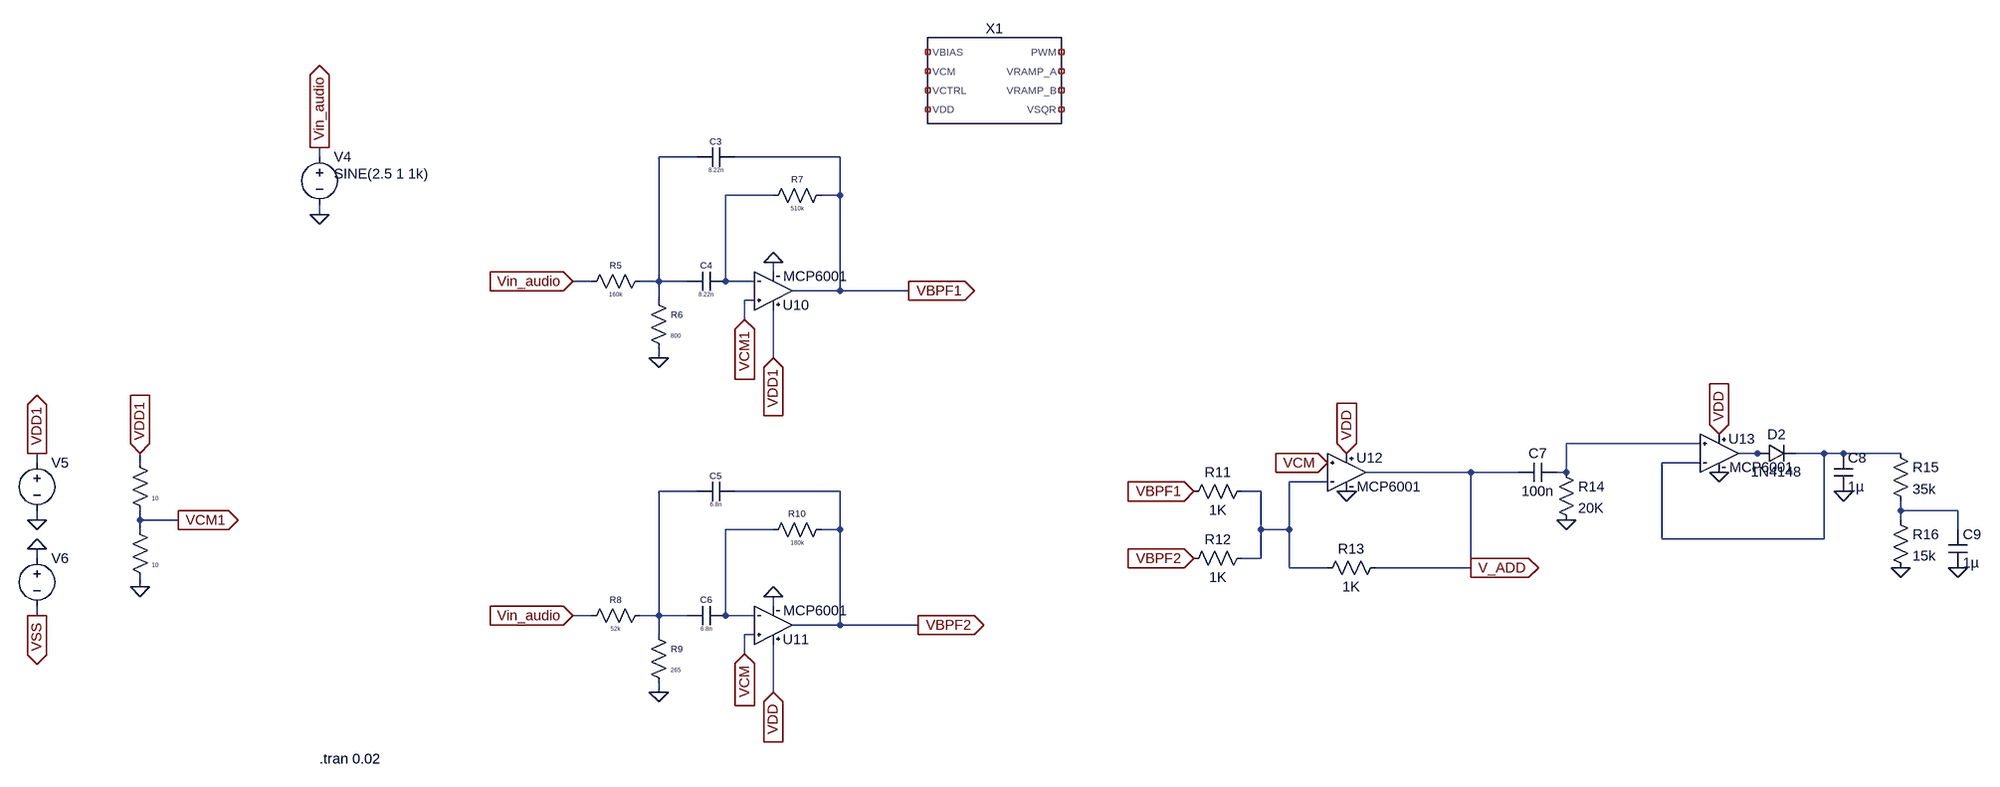
[diagram p0: schematic Draft1.asc]
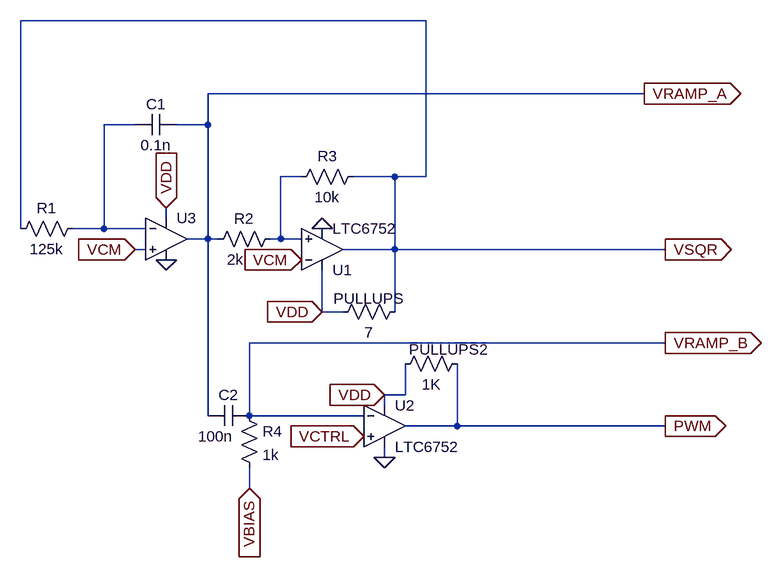
[diagram p1: sub-circuit analoglab_1.asc]
Draft1.asc, the LTspice schematic file:
Version 4.1
SHEET 1 1768 1856
WIRE -1328 832 -1328 816
WIRE -496 832 -560 832
WIRE -256 832 -432 832
WIRE -368 896 -448 896
WIRE -256 896 -256 832
WIRE -256 896 -288 896
WIRE -1328 928 -1328 912
WIRE -368 1024 -368 1008
WIRE -672 1040 -704 1040
WIRE -560 1040 -560 832
WIRE -560 1040 -592 1040
WIRE -512 1040 -560 1040
WIRE -448 1040 -448 896
WIRE -400 1040 -448 1040
WIRE -256 1056 -256 896
WIRE -256 1056 -336 1056
WIRE -128 1056 -256 1056
WIRE -560 1072 -560 1040
WIRE -400 1072 -416 1072
WIRE -416 1104 -416 1072
WIRE -560 1168 -560 1152
WIRE -368 1168 -368 1088
WIRE 1296 1312 1072 1312
WIRE 1392 1328 1360 1328
WIRE 1408 1328 1392 1328
WIRE 1504 1328 1456 1328
WIRE 1536 1328 1504 1328
WIRE 1632 1328 1536 1328
WIRE -1888 1344 -1888 1328
WIRE -1712 1344 -1712 1328
WIRE 1296 1344 1232 1344
WIRE 912 1360 736 1360
WIRE 992 1360 912 1360
WIRE 1072 1360 1072 1312
WIRE 1072 1360 1056 1360
WIRE 672 1376 608 1376
WIRE -496 1392 -560 1392
WIRE -256 1392 -432 1392
WIRE 560 1392 528 1392
WIRE 1632 1424 1632 1408
WIRE 1728 1424 1632 1424
WIRE -1888 1440 -1888 1424
WIRE -1712 1440 -1712 1424
WIRE -1648 1440 -1712 1440
WIRE 1632 1440 1632 1424
WIRE -1712 1456 -1712 1440
WIRE -368 1456 -448 1456
WIRE -256 1456 -256 1392
WIRE -256 1456 -288 1456
WIRE 560 1456 560 1392
WIRE 608 1456 608 1376
WIRE 608 1456 560 1456
WIRE 1728 1456 1728 1424
WIRE 1232 1472 1232 1344
WIRE 1504 1472 1504 1328
WIRE 1504 1472 1232 1472
WIRE -1888 1504 -1888 1488
WIRE 560 1504 560 1456
WIRE 560 1504 528 1504
WIRE 608 1520 608 1456
WIRE 672 1520 608 1520
WIRE 912 1520 912 1360
WIRE 912 1520 752 1520
WIRE -1712 1552 -1712 1536
WIRE -368 1584 -368 1568
WIRE -1888 1600 -1888 1584
WIRE -672 1600 -704 1600
WIRE -560 1600 -560 1392
WIRE -560 1600 -592 1600
WIRE -512 1600 -560 1600
WIRE -448 1600 -448 1456
WIRE -400 1600 -448 1600
WIRE -256 1616 -256 1456
WIRE -256 1616 -336 1616
WIRE -112 1616 -256 1616
WIRE -560 1632 -560 1600
WIRE -400 1632 -416 1632
WIRE -416 1664 -416 1632
WIRE -560 1728 -560 1712
WIRE -368 1728 -368 1648
FLAG -560 1168 0
FLAG -704 1040 Vin_audio
IOPIN -704 1040 In
FLAG -560 1728 0
FLAG -704 1600 Vin_audio
IOPIN -704 1600 In
FLAG -416 1104 VCM1
IOPIN -416 1104 In
FLAG -416 1664 VCM
IOPIN -416 1664 In
FLAG -112 1616 VBPF2
IOPIN -112 1616 Out
FLAG -128 1056 VBPF1
IOPIN -128 1056 Out
FLAG 912 1520 V_ADD
IOPIN 912 1520 Out
FLAG 448 1392 VBPF1
IOPIN 448 1392 In
FLAG 448 1504 VBPF2
IOPIN 448 1504 In
FLAG 672 1344 VCM
IOPIN 672 1344 In
FLAG 1072 1440 0
FLAG 1536 1392 0
FLAG -368 1568 0
FLAG -368 1008 0
FLAG -368 1168 VDD1
IOPIN -368 1168 In
FLAG -368 1728 VDD
IOPIN -368 1728 In
FLAG 704 1392 0
FLAG 1328 1360 0
FLAG 704 1328 VDD
IOPIN 704 1328 In
FLAG 1328 1296 VDD
IOPIN 1328 1296 In
FLAG 1632 1520 0
FLAG 1728 1520 0
FLAG -1328 816 Vin_audio
IOPIN -1328 816 Out
FLAG -1328 928 0
FLAG -1888 1440 0
FLAG -1888 1328 VDD1
IOPIN -1888 1328 Out
FLAG -1888 1488 0
FLAG -1888 1600 VSS
IOPIN -1888 1600 Out
FLAG -1712 1552 0
FLAG -1712 1328 VDD1
IOPIN -1712 1328 In
FLAG -1648 1440 VCM1
IOPIN -1648 1440 Out
SYMBOL analoglab_1 16 704 R0
SYMATTR InstName X1
SYMBOL res -576 1024 R90
WINDOW 0 0 56 VBottom 1
WINDOW 3 32 56 VTop 0
SYMATTR InstName R5
SYMATTR Value 160k
SYMBOL res -576 1056 R0
WINDOW 0 36 40 Left 1
WINDOW 3 36 76 Left 0
SYMATTR InstName R6
SYMATTR Value 800
SYMBOL res -384 912 R270
WINDOW 0 32 56 VTop 1
WINDOW 3 0 56 VBottom 0
SYMATTR InstName R7
SYMATTR Value 510k
SYMBOL cap -432 816 R90
WINDOW 0 0 32 VBottom 1
WINDOW 3 32 32 VTop 0
SYMATTR InstName C3
SYMATTR Value 8.22n
SYMBOL cap -448 1024 R90
WINDOW 0 0 32 VBottom 1
WINDOW 3 32 32 VTop 0
SYMATTR InstName C4
SYMATTR Value 8.22n
SYMBOL res -576 1584 R90
WINDOW 0 0 56 VBottom 1
WINDOW 3 32 56 VTop 0
SYMATTR InstName R8
SYMATTR Value 52k
SYMBOL res -576 1616 R0
WINDOW 0 36 40 Left 1
WINDOW 3 36 76 Left 0
SYMATTR InstName R9
SYMATTR Value 265
SYMBOL res -384 1472 R270
WINDOW 0 32 56 VTop 1
WINDOW 3 0 56 VBottom 0
SYMATTR InstName R10
SYMATTR Value 180k
SYMBOL cap -432 1376 R90
WINDOW 0 0 32 VBottom 1
WINDOW 3 32 32 VTop 0
SYMATTR InstName C5
SYMATTR Value 6.8n
SYMBOL cap -448 1584 R90
WINDOW 0 0 32 VBottom 1
WINDOW 3 32 32 VTop 0
SYMATTR InstName C6
SYMATTR Value 6.8n
SYMBOL res 544 1376 R90
WINDOW 0 0 56 VBottom 2
WINDOW 3 32 56 VTop 2
SYMATTR InstName R11
SYMATTR Value 1K
SYMBOL res 544 1488 R90
WINDOW 0 0 56 VBottom 2
WINDOW 3 32 56 VTop 2
SYMATTR InstName R12
SYMATTR Value 1K
SYMBOL res 768 1504 R90
WINDOW 0 0 56 VBottom 2
WINDOW 3 32 56 VTop 2
SYMATTR InstName R13
SYMATTR Value 1K
SYMBOL cap 1056 1344 R90
WINDOW 0 0 32 VBottom 2
WINDOW 3 32 32 VTop 2
SYMATTR InstName C7
SYMATTR Value 100n
SYMBOL res 1056 1344 R0
SYMATTR InstName R14
SYMATTR Value 20K
SYMBOL cap 1520 1328 R0
SYMATTR InstName C8
SYMATTR Value 1µ
SYMBOL res 1616 1312 R0
SYMATTR InstName R15
SYMATTR Value 35k
SYMBOL diode 1392 1344 R270
WINDOW 0 32 32 VTop 2
WINDOW 3 0 32 VBottom 2
SYMATTR InstName D2
SYMATTR Value 1N4148
SYMBOL res 1616 1424 R0
SYMATTR InstName R16
SYMATTR Value 15k
SYMBOL cap 1712 1456 R0
SYMATTR InstName C9
SYMATTR Value 1µ
SYMBOL MCP6001 -368 1056 M180
SYMATTR InstName U10
SYMBOL MCP6001 -368 1616 M180
SYMATTR InstName U11
SYMBOL MCP6001 704 1360 R0
SYMATTR InstName U12
SYMBOL MCP6001 1328 1328 R0
SYMATTR InstName U13
SYMBOL voltage -1328 816 R0
WINDOW 3 24 44 Left 2
WINDOW 39 0 0 Left 0
WINDOW 123 24 72 Left 2
SYMATTR Value SINE(2.5 1 1k)
SYMATTR InstName V4
SYMBOL voltage -1888 1328 R0
WINDOW 3 24 96 Invisible 2
SYMATTR Value 5
SYMATTR InstName V5
SYMBOL voltage -1888 1488 R0
WINDOW 3 24 96 Invisible 2
SYMATTR Value 5
SYMATTR InstName V6
SYMBOL res -1728 1328 R0
WINDOW 0 36 40 Invisible 2
WINDOW 3 36 76 Left 0
SYMATTR InstName R17
SYMATTR Value 10
SYMBOL res -1728 1440 R0
WINDOW 0 36 40 Invisible 2
WINDOW 3 36 76 Left 0
SYMATTR InstName R18
SYMATTR Value 10
TEXT -1328 1840 Left 2 !.tran 0.02

analoglab_1.asc, the sub-circuit schematic file:
Version 4.1
SHEET 1 1268 728
WIRE 576 -176 -48 -176
WIRE 912 -64 240 -64
WIRE 128 -16 80 -16
WIRE 240 -16 240 -64
WIRE 240 -16 192 -16
WIRE 384 64 352 64
WIRE 528 64 464 64
WIRE 576 64 576 -176
WIRE 576 64 528 64
WIRE 176 128 176 112
WIRE -48 144 -48 -176
WIRE 80 144 80 -16
WIRE 80 144 32 144
WIRE 144 144 80 144
WIRE 240 160 240 -16
WIRE 240 160 208 160
WIRE 256 160 240 160
WIRE 352 160 352 64
WIRE 352 160 336 160
WIRE 384 160 352 160
WIRE 144 176 128 176
WIRE 528 176 528 64
WIRE 528 176 448 176
WIRE 944 176 528 176
WIRE 416 272 416 208
WIRE 448 272 416 272
WIRE 528 272 528 176
WIRE 944 320 304 320
WIRE 544 400 544 352
WIRE 544 400 512 400
WIRE 512 416 512 400
WIRE 240 432 240 160
WIRE 304 432 304 320
WIRE 480 432 304 432
WIRE 624 448 624 352
WIRE 624 448 544 448
WIRE 944 448 624 448
WIRE 512 496 512 480
WIRE 304 544 304 512
FLAG 512 496 0
FLAG 176 192 0
FLAG 128 176 VCM
IOPIN 128 176 In
FLAG 176 112 VDD
IOPIN 176 112 In
FLAG 416 272 VDD
IOPIN 416 272 In
FLAG 512 400 VDD
IOPIN 512 400 In
FLAG 480 464 VCTRL
IOPIN 480 464 In
FLAG 384 192 VCM
IOPIN 384 192 In
FLAG 912 -64 VRAMP_A
IOPIN 912 -64 Out
FLAG 944 320 VRAMP_B
IOPIN 944 320 Out
FLAG 944 176 VSQR
IOPIN 944 176 Out
FLAG 944 448 PWM
IOPIN 944 448 Out
FLAG 416 144 0
FLAG 304 544 VBIAS
IOPIN 304 544 In
SYMBOL res 48 128 R90
WINDOW 0 0 56 VBottom 2
WINDOW 3 32 56 VTop 2
SYMATTR InstName R1
SYMATTR Value 125k
SYMBOL res 352 144 R90
WINDOW 0 0 56 VBottom 2
WINDOW 3 32 70 VTop 2
SYMATTR InstName R2
SYMATTR Value 2k
SYMBOL res 480 48 R90
WINDOW 0 0 56 VBottom 2
WINDOW 3 32 56 VTop 2
SYMATTR InstName R3
SYMATTR Value 10k
SYMBOL cap 304 416 R90
WINDOW 0 0 32 VBottom 2
WINDOW 3 32 52 VTop 2
SYMATTR InstName C2
SYMATTR Value 100n
SYMBOL res 288 416 R0
SYMATTR InstName R4
SYMATTR Value 1k
SYMBOL res 544 256 R90
WINDOW 0 11 56 VBottom 2
WINDOW 3 32 56 VTop 2
SYMATTR InstName PULLUPS
SYMATTR Value 7
SYMBOL res 640 336 R90
WINDOW 0 10 29 VBottom 2
WINDOW 3 32 56 VTop 2
SYMATTR InstName PULLUPS2
SYMATTR Value 1K
SYMBOL cap 192 -32 R90
WINDOW 0 0 32 VBottom 2
WINDOW 3 32 32 VTop 2
SYMATTR InstName C1
SYMATTR Value 0.1n
SYMBOL Comparators\\LTC6752 512 384 R0
SYMATTR InstName U2
SYMBOL Comparators\\LTC6752 416 240 M180
SYMATTR InstName U1
SYMBOL Opamps\\UniversalOpamp2 176 160 R0
SYMATTR InstName U3

The netlist it stands for:
* Draft1.asc
X§X1 NC_01 NC_02 NC_03 NC_04 NC_05 NC_06 NC_07 NC_08 analoglab_1
R5 N001 Vin_audio 160k
R6 N001 0 800
R7 N002 VBPF1 510k
C3 VBPF1 N001 8.22n
C4 N002 N001 8.22n
R8 N007 Vin_audio 52k
R9 N007 0 265
R10 N009 VBPF2 180k
C5 VBPF2 N007 6.8n
C6 N009 N007 6.8n
R11 N006 VBPF1 1K
R12 N006 VBPF2 1K
R13 V_ADD N006 1K
C7 N003 V_ADD 100n
R14 N003 0 20K
C8 N005 0 1µ
R15 N005 N008 35k
D2 N004 N005 1N4148
R16 N008 0 15k
C9 N008 0 1µ
X§U10 VCM1 N002 VDD1 0 VBPF1 MCP6001
X§U11 VCM N009 VDD 0 VBPF2 MCP6001
X§U12 VCM N006 VDD 0 V_ADD MCP6001
X§U13 N003 N005 VDD 0 N004 MCP6001
V4 Vin_audio 0 SINE(2.5 1 1k)
V5 VDD1 0 5
V6 0 VSS 5
R17 VDD1 VCM1 10
R18 VCM1 0 10

* block symbol definitions
.subckt analoglab_1 VBIAS VCM VCTRL VDD PWM VRAMP_A VRAMP_B VSQR
R1 N001 VSQR 125k
R2 N002 VRAMP_A 2k
R3 VSQR N002 10k
C2 VRAMP_B VRAMP_A 100n
R4 VRAMP_B VBIAS 1k
R§PULLUPS VSQR VDD 7
R§PULLUPS2 PWM VDD 1K
C1 VRAMP_A N001 0.1n
X§U2 VCTRL VRAMP_B VDD 0 PWM LTC6752  ; pins In+ In- V+ V- OUT
X§U1 N002 VCM VDD 0 VSQR LTC6752  ; pins In+ In- V+ V- OUT
X§U3 VCM N001 VDD 0 VRAMP_A level.2 Avol=1Meg GBW=10Meg Slew=10Meg ilimit=25m rail=0 Vos=0 phimargin=45 en=0 enk=0 in=0 ink=0 Rin=500Meg  ; pins IN+ IN- V+ V- OUT
.ends analoglab_1

.model D D
.lib standard.dio
.tran 0.02
.lib LTC7.lib
.lib UniversalOpamps2.sub
.lib C:\Users\Sripathi\Downloads\lab2\MCP6001.lib
.backanno
.end